# Altium project Mother_board_sauvc_2025.PrjPcb
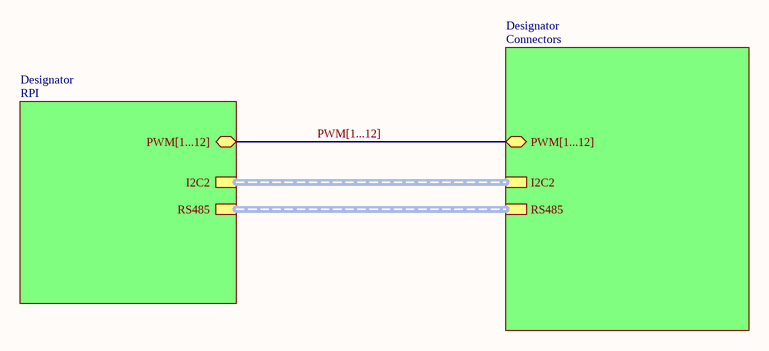
[diagram p0: Mother_board_sauvc_2025.SchDoc]
4 sheets, 34 parts. Net scope: global (net labels, ports and power ports of the same name join across sheets).
Board file: Mother_board_sauvc_2025.PcbDoc
Sheets:
  Mother_board_sauvc_2025.SchDoc
    Designator = RPI.SchDoc
    Designator = Connectors.SchDoc
  Power.SchDoc

## Sheet Mother_board_sauvc_2025.SchDoc
size A4; SheetNumber: 1; SheetTotal: 4

### Sub-sheets
Designator = RPI: PWM[1...12] (bidir), I2C2 (harness *), RS485 (harness *)
Designator = Connectors: PWM[1...12] (bidir), I2C2 (harness *), RS485 (harness *)

### Buses and harness runs
bus PWM[1...12] = sheet Designator/PWM[1...12]

## Sheet RPI.SchDoc
size A3; SheetNumber: 2; SheetTotal: 4
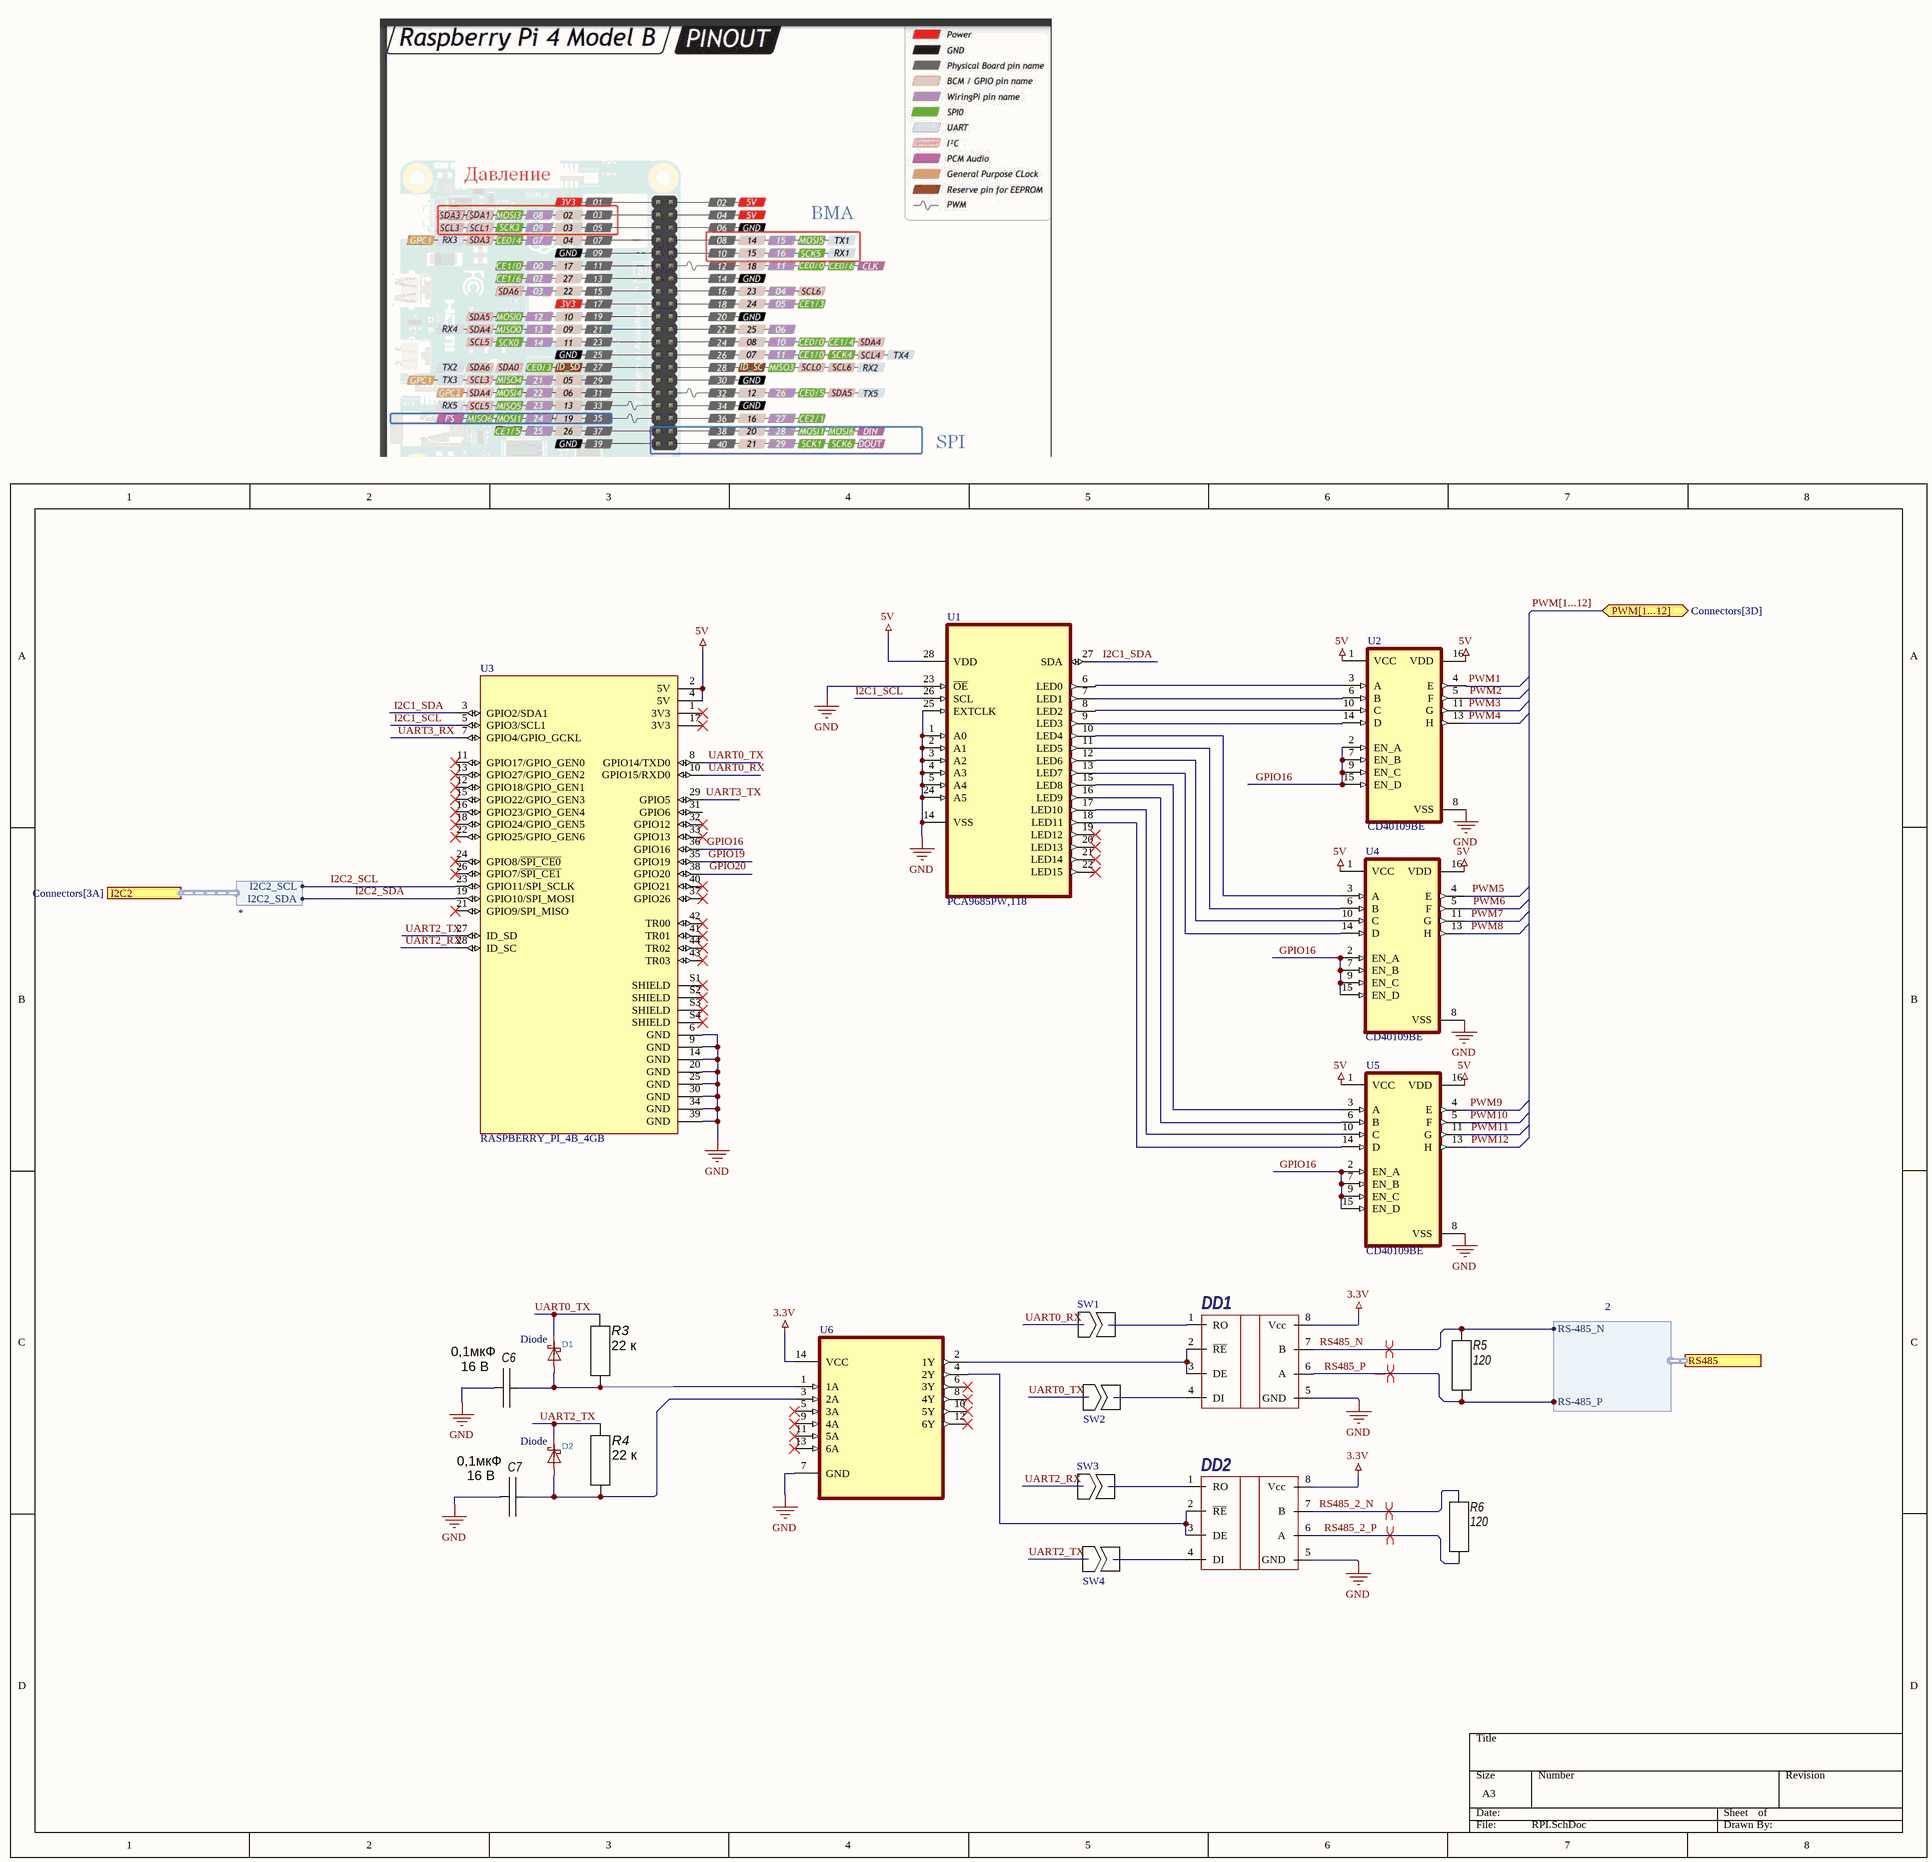
[diagram p1: RPI.SchDoc]

### Parts
C6  Voltage: 16 В  [C0603C]  (hidden comment: 0,1мкФ)
C7  Voltage: 16 В  [C0603C]  (hidden comment: 0,1мкФ)
D1  Diode  [SOD-123F]
D2  Diode  [SOD-123F]
DD1  (no value)  [SOIC8N]
DD2  (no value)  [SOIC8N]
R3  22 к  [C0603R]
R4  22 к  [C0603R]
R5  120  [C0603R]
R6  120  [C0603R]
SW1  SW2  [SW2]  (value not drawn)
SW2  SW2  [SW2]  (value not drawn)
SW3  SW2  [SW2]  (value not drawn)
SW4  SW2  [SW2]  (value not drawn)
U1  PCA9685PW,118  [SOP65P640X110-28N]
U2  CD40109BE  [DIP794W45P254L1969H508Q16]
U3  RASPBERRY_PI_4B_4GB  [PLD40]
U4  CD40109BE  [DIP794W45P254L1969H508Q16]
U5  CD40109BE  [DIP794W45P254L1969H508Q16]
U6  (no value)  [SOIC127P600X175-14N]

### Ports
I2C2 (harness *, see Connectors[3A]), PWM[1...12] (bidir, see Connectors[3D]), RS485 (harness 2, see Connectors[1C])

### Harnesses
*: I2C2_SCL, I2C2_SDA
2: RS-485_N, RS-485_P

### Nets
3.3V: DD1.8(Vcc) DD2.8(Vcc) U6.14(VCC)
5V: U1.28(VDD) U2.1(VCC) U2.16(VDD) U3.2(5V) U3.4(5V) U4.1(VCC) U4.16(VDD) U5.1(VCC) U5.16(VDD)
GND: C6.2 C7.2 DD1.5(GND) DD2.5(GND) U1.1(A0) U1.2(A1) U1.3(A2) U1.4(A3) U1.5(A4) U1.14(VSS) U1.23(~{OE}) U1.24(A5) U1.25(EXTCLK) U2.8(VSS) U3.6(GND) U3.9(GND) U3.14(GND) U3.20(GND) U3.25(GND) U3.30(GND) U3.34(GND) U3.39(GND) U4.8(VSS) U5.8(VSS) U6.7(GND)
GPIO16: U2.2(EN_A) U2.7(EN_B) U2.9(EN_C) U2.15(EN_D) U3.36(GPIO16) U4.2(EN_A) U4.7(EN_B) U4.9(EN_C) U4.15(EN_D) U5.2(EN_A) U5.7(EN_B) U5.9(EN_C) U5.15(EN_D)
GPIO19: U3.35(GPIO19)
GPIO20: U3.38(GPIO20)
I2C1_SCL: U1.26(SCL) U3.5(GPIO3/SCL1)
I2C1_SDA: U1.27(SDA) U3.3(GPIO2/SDA1)
I2C2_SCL: U3.23(GPIO11/SPI_SCLK) ; port I2C2.I2C2_SCL
I2C2_SDA: U3.19(GPIO10/SPI_MOSI) ; port I2C2.I2C2_SDA
PWM1: U2.4(E)
PWM2: U2.5(F)
PWM3: U2.11(G)
PWM4: U2.13(H)
PWM5: U4.4(E)
PWM6: U4.5(F)
PWM7: U4.11(G)
PWM8: U4.13(H)
PWM9: U5.4(E)
PWM10: U5.5(F)
PWM11: U5.11(G)
PWM12: U5.13(H)
RS485_2_N: DD2.7(B) R6.1
RS485_2_P: DD2.6(A) R6.2
RS485_N: DD1.7(B) R5.1 ; port RS485.RS-485_N  [project net RS-485_N]
RS485_P: DD1.6(A) R5.2 ; port RS485.RS-485_P  [project net RS-485_P]
UART0_RX: SW1.1 U3.10(GPIO15/RXD0)
UART0_TX: D1.K R3.1 SW2.1 U3.8(GPIO14/TXD0)
UART2_RX: SW3.1 U3.28(ID_SC)
UART2_TX: D2.K R4.1 SW4.1 U3.27(ID_SD)
UART3_RX: U3.7(GPIO4/GPIO_GCKL)
UART3_TX: U3.29(GPIO5)
NetC6_1: C6.1 D1.A R3.2 U6.1(1A)
NetC7_1: C7.1 D2.A R4.2 U6.3(2A)
NetDD1_1: DD1.1(RO) SW1.2
NetDD1_2: DD1.2(~{RE}) DD1.3(DE) U6.2(1Y)
NetDD1_4: DD1.4(DI) SW2.2
NetDD2_1: DD2.1(RO) SW3.2
NetDD2_2: DD2.2(~{RE}) DD2.3(DE) U6.4(2Y)
NetDD2_4: DD2.4(DI) SW4.2
NetU1_6: U1.6(LED0) U2.3(A)
NetU1_7: U1.7(LED1) U2.6(B)
NetU1_8: U1.8(LED2) U2.10(C)
NetU1_9: U1.9(LED3) U2.14(D)
NetU1_10: U1.10(LED4) U4.3(A)
NetU1_11: U1.11(LED5) U4.6(B)
NetU1_12: U1.12(LED6) U4.10(C)
NetU1_13: U1.13(LED7) U4.14(D)
NetU1_15: U1.15(LED8) U5.3(A)
NetU1_16: U1.16(LED9) U5.6(B)
NetU1_17: U1.17(LED10) U5.10(C)
NetU1_18: U1.18(LED11) U5.14(D)

Not connected (* = marked no-connect by the designer): U1 19(LED12)* 20(LED13)* 21(LED14)* 22(LED15)*; U3 1(3V3)* 11(GPIO17/GPIO_GEN0)* 12(GPIO18/GPIO_GEN1)* 13(GPIO27/GPIO_GEN2)* 15(GPIO22/GPIO_GEN3)* 16(GPIO23/GPIO_GEN4)* 17(3V3)* 18(GPIO24/GPIO_GEN5)* 21(GPIO9/SPI_MISO)* 22(GPIO25/GPIO_GEN6)* 24(GPIO8/~{SPI_CE0})* 26(GPIO7/~{SPI_CE1})* 31(GPIO6) 32(GPIO12)* 33(GPIO13)* 37(GPIO26)* 40(GPIO21)* 41(TR01)* 42(TR00)* 43(TR03)* 44(TR02)* S1(SHIELD)* S2(SHIELD)* S3(SHIELD)* S4(SHIELD)*; U6 5(3A)* 6(3Y)* 8(4Y)* 9(4A)* 10(5Y)* 11(5A)* 12(6Y)* 13(6A)*

### Buses and harness runs
bus PWM[1...12] = port PWM[1...12]

### Layout directives
differential pair: RS485_2_N, RS485_2_P, RS-485_N, RS-485_P

### Library data of the parts
C6 C7 = CL10B152KB8NNNC: SMD 0603 ; X7R; 1,5 нФ; 50 В; Manufacturer: SAMSUNG; Persent: ±15%; Type: Ceramic; Part Number: CL10B152KB8NNNC; Package: SMD 0603; Dielectric: X7R; ComponentLink1Description: Datasheet; Value: 0,1мкФ
D1 D2 = Schottky-Diode: ki_description: Schottky Diode; Datasheet: https://diotec.com/de/produktliste/SBD.html; ki_keywords: Schottky
DD1 DD2 = MAX3072E: Half-duplex; Manufacturer: MAXIM; Rate: 3.3v; Notice: True fail-safe; Datasheet: https://static.chipdip.ru/lib/276/DOC000276899.pdf; Shop: https://www.chipdip.ru/product/max3072eesa; Case: soic-8(0.154 inch)
R3 R4 = RC0603FR-0722KL: SMD 0603; 0,1; 1%; 22 кОм; Manufacturer: Yageo; Power: 0,1; TCR: 200 ppm; Part Number: RC0603FR-0722KL; Package: SMD 0603; Persent: 1%; Category: R; Value: 22 к
R5 R6 = RC0603FR-07120RL: SMD 0603; 0,1; 1%; 120 Ом; Manufacturer: Yageo; Power: 0,1; TCR: 200 ppm; Part Number: RC0603FR-07120RL; Package: SMD 0603; Persent: 1%; Value: 120; Category: R
U1 = PCA9685PW,118: LED Driver IC 16 Output Linear - PWM Dimming 25mA 28-TSSOP; MF: NXP USA; Value: *; MP: PCA9685PW,118; Purchase-URL: https://pricing.snapeda.com/search/part/PCA9685PW,118/?ref=eda; Availability: In Stock; Price: None; Package: TSSOP-28 NXP Semiconductors
U2 U4 U5 = CD40109BE: Ð§ÐµÑ‚Ñ‹Ñ€ÐµÑ…ÑŠÑÐ´ÐµÑ€Ð½Ñ‹Ð¹ ÐšÐœÐžÐŸ-Ð¿Ñ€ÐµÐ¾Ð±Ñ€Ð°Ð·Ð¾Ð²Ð°Ñ‚ÐµÐ»ÑŒ Ð½Ð¸Ð·ÐºÐ¾Ð³Ð¾ Ð½Ð°Ð¿Ñ€ÑÐ¶ÐµÐ½Ð¸Ñ Ð² Ð²Ñ‹ÑÐ¾ÐºÐ¾Ðµ (Ð½Ð¾Ð¼Ð¸Ð½Ð°Ð»ÑŒÐ½Ð¾Ðµ Ð½Ð°Ð¿Ñ€ÑÐ¶ÐµÐ½Ð¸Ðµ 20 Ð’); MF: Texas Instruments; SnapEDA_Link: https://www.snapeda.com/parts/CD40109BE/Texas+Instruments/view-part/?ref=snap; Package: PDIP-16 Texas Instruments; Value: *; MP: CD40109BE; Check_prices: https://www.snapeda.com/parts/CD40109BE/Texas+Instruments/view-part/?ref=eda
U3 = RASPBERRY_PI_4B_4GB: BCM2711 Raspberry Pi 4 Model B 4GB - ARMÂ® CortexÂ®-A72 MPU Embedded Evaluation Board; MP: RASPBERRY PI 4B/4GB; Price: None; MF: Raspberry Pi; Check_prices: https://www.snapeda.com/parts/RASPBERRY%20PI%204B/4GB/Raspberry+Pi/view-part/?ref=eda; Value: *; Purchase-URL: https://pricing.snapeda.com/search/part/RASPBERRY PI 4B/4GB/?ref=eda; Availability: In Stock; SnapEDA_Link: https://www.snapeda.com/parts/RASPBERRY%20PI%204B/4GB/Raspberry+Pi/view-part/?ref=snap; Package: None
U6 = 74HC14D: Inverter IC 6 Channel Schmitt Trigger 14-SOIC; MF: Toshiba; SnapEDA_Link: https://www.snapeda.com/parts/74HC14D/Toshiba+Semiconductor+and+Storage/view-part/?ref=snap; Availability: In Stock; Price: None; Package: SO14-14 Nexperia USA Inc.; Purchase-URL: https://pricing.snapeda.com/search/part/74HC14D/?ref=eda; Check_prices: https://www.snapeda.com/parts/74HC14D/Toshiba+Semiconductor+and+Storage/view-part/?ref=eda; Value: *; MP: 74HC14D

## Sheet Connectors.SchDoc
size A4; SheetNumber: 3; SheetTotal: 4
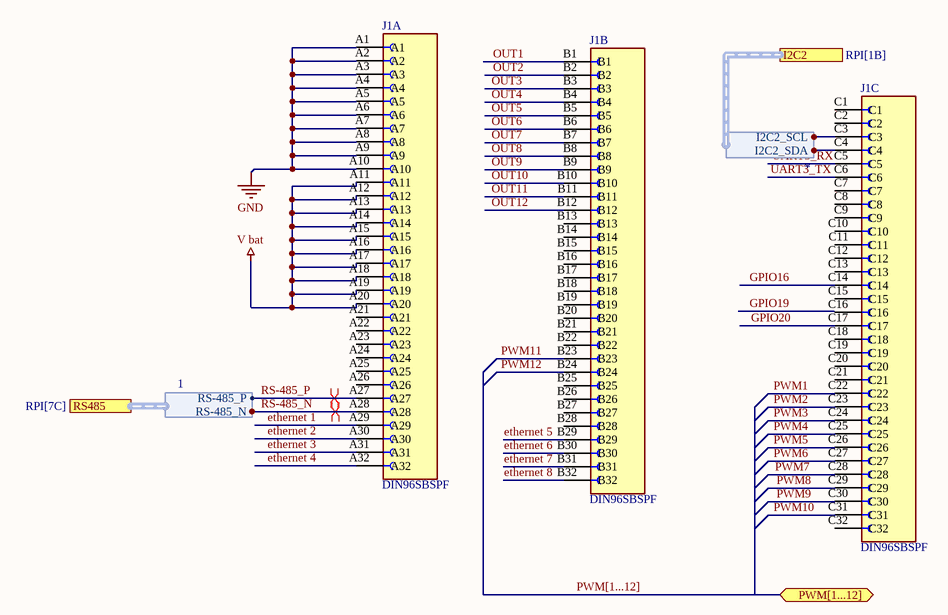
[diagram p2: Connectors.SchDoc]

### Parts
J1  DIN96SBSPF  [CINCH_DIN96SBSPF]  (parts A,B,C of 3)

### Ports
I2C2 (harness *, see RPI[1B]), PWM[1...12] (bidir, see RPI[7A]), RS485 (harness 1, see RPI[7C])

### Harnesses
1: RS-485_P, RS-485_N
*: I2C2_SCL, I2C2_SDA

### Nets
GND: J1.A1 J1.A2 J1.A3 J1.A4 J1.A5 J1.A6 J1.A7 J1.A8 J1.A9 J1.A10
V bat: J1.A11 J1.A12 J1.A13 J1.A14 J1.A15 J1.A16 J1.A17 J1.A18 J1.A19 J1.A20
ethernet 1: J1.A29
ethernet 2: J1.A30
ethernet 3: J1.A31
ethernet 4: J1.A32
ethernet 5: J1.B29
ethernet 6: J1.B30
ethernet 7: J1.B31
ethernet 8: J1.B32
GPIO16: J1.C14
GPIO20: J1.C17
I2C2_SCL: J1.C3 ; port I2C2.I2C2_SCL
I2C2_SDA: J1.C4 ; port I2C2.I2C2_SDA
OUT1: J1.B1
OUT2: J1.B2
OUT3: J1.B3
OUT4: J1.B4
OUT5: J1.B5
OUT6: J1.B6
OUT7: J1.B7
OUT8: J1.B8
OUT9: J1.B9
OUT10: J1.B10
OUT11: J1.B11
OUT12: J1.B12
PWM1: J1.C22
PWM2: J1.C23
PWM3: J1.C24
PWM4: J1.C25
PWM5: J1.C26
PWM6: J1.C27
PWM7: J1.C28
PWM8: J1.C29
PWM9: J1.C30
PWM10: J1.C31
PWM11: J1.B23
PWM12: J1.B24
RS-485_N: J1.A28 ; port RS485.RS-485_N
RS-485_P: J1.A27 ; port RS485.RS-485_P
UART3_RX: J1.C5
UART3_TX: J1.C6

Not connected (* = marked no-connect by the designer): J1 A21 A22 A23 A24 A25 A26 B13 B14 B15 B16 B17 B18 B19 B20 B21 B22 B25 B26 B27 B28 C1 C2 C7 C8 C9 C10 C11 C12 C13 C15 C16 C18 C19 C20 C21 C32

### Buses and harness runs
bus PWM[1...12] = port PWM[1...12]

### Layout directives
differential pair: RS-485_N, RS-485_P

### Library data of the parts
J1 = DIN96SBSPF: DIN 41612 socket, fully populated, 96 contacts, straight PCB mounted, press-fit pins; MF: Cinch Connectivity Solutions; Package: None; Price: None; Check_prices: https://www.snapeda.com/parts/DIN96SBSPF/Cinch+Connectivity+Solutions/view-part/?ref=eda; Value: *; SnapEDA_Link: https://www.snapeda.com/parts/DIN96SBSPF/Cinch+Connectivity+Solutions/view-part/?ref=snap; MP: DIN96SBSPF; Availability: In Stock; Purchase-URL: https://pricing.snapeda.com/search?q=DIN96SBSPF&ref=eda

## Sheet Power.SchDoc
size A4; SheetNumber: 4; SheetTotal: 4
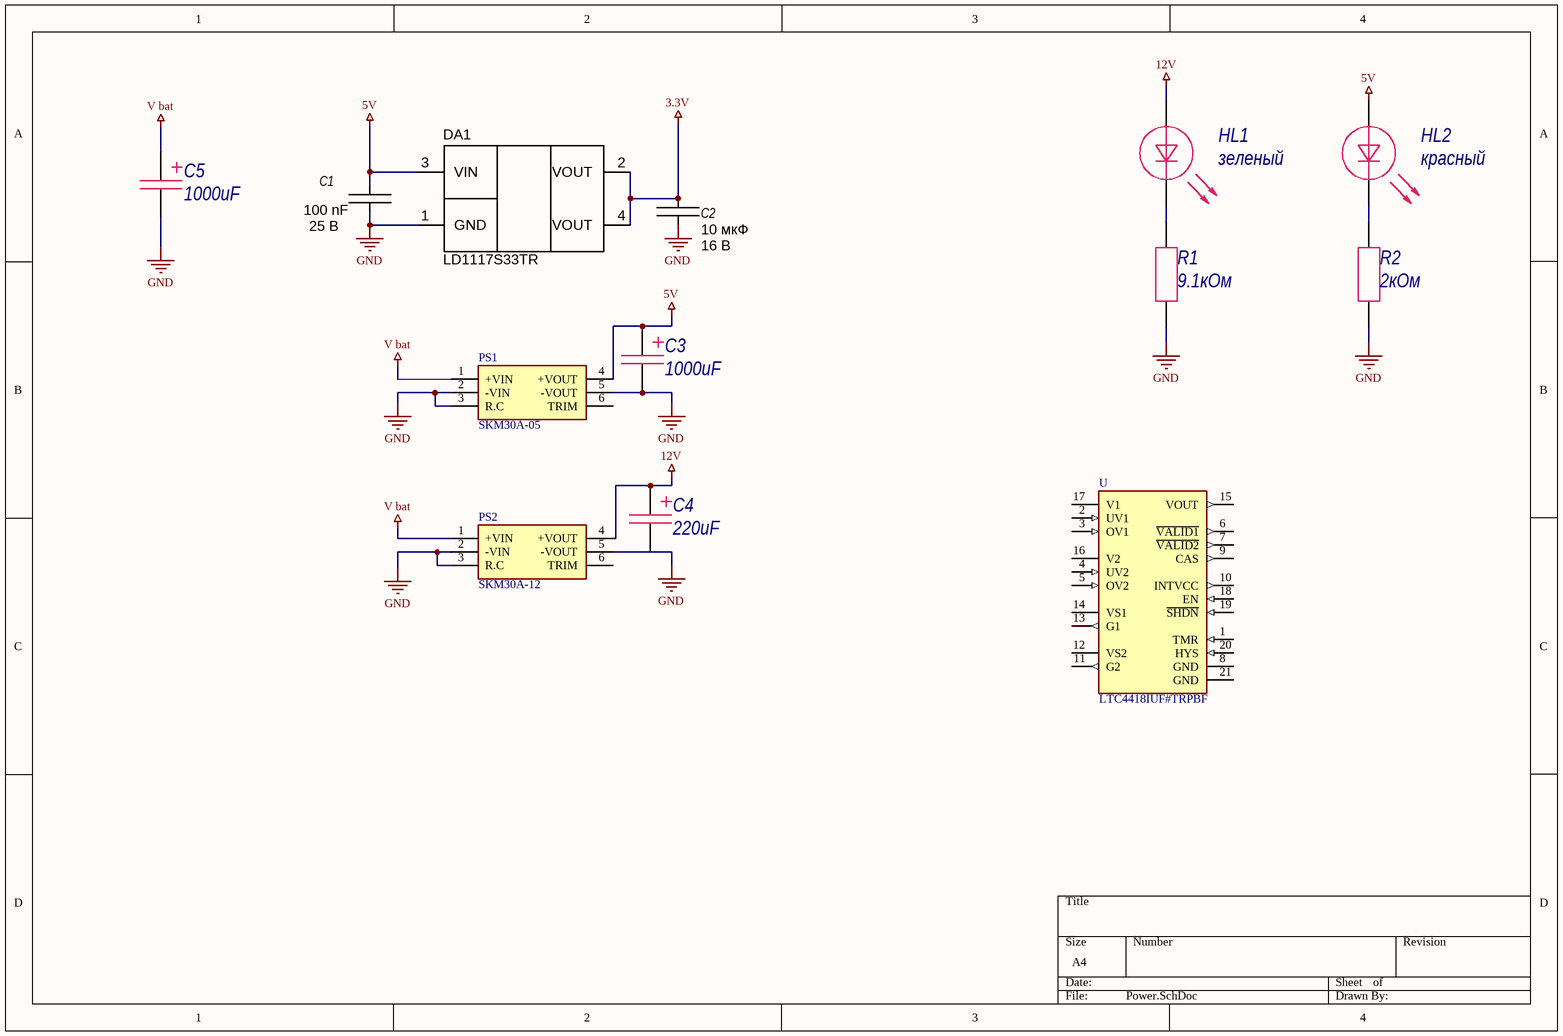
[diagram p3: Power.SchDoc]

### Parts
C1  Voltage: 25 В  [C0402C]  (hidden comment: 100 nF)
C2  Voltage: 16 В  [C0805C]  (hidden comment: 10 мкФ)
C3  value 1000uF  [Capacitor 8x12]  (hidden comment: 1uF)
C4  value 220uF  [Capacitor 8x12]  (hidden comment: 1uF)
C5  value 1000uF  [Capacitor 10x12]  (hidden comment: 1uF)
DA1  LD1117S33TR  [SOT-223]
HL1  Color: зеленый  [0805D]
HL2  Color: красный  [0805D]
PS1  SKM30A-05  [SKM30A05]
PS2  SKM30A-12  [SKM30B12]
R1  value 9.1кОм  [0805R]  (hidden comment: Resistor)
R2  value 2кОм  [0805R]  (hidden comment: Resistor)
U  LTC4418IUF#TRPBF  [QFN50P400X400X80-21N]

### Nets
3.3V: C2.1 DA1.2(VOUT) DA1.4(VOUT)
5V: C1.1 C3.1 DA1.3(VIN) HL2.1 PS1.4(+VOUT)
12V: C4.1 HL1.1 PS2.4(+VOUT)
GND: C1.2 C2.2 C3.2 C4.2 C5.2 DA1.1(GND) PS1.2(-VIN) PS1.3(R.C) PS1.5(-VOUT) PS2.2(-VIN) PS2.3(R.C) PS2.5(-VOUT) R1.1 R2.1
V bat: C5.1 PS1.1(+VIN) PS2.1(+VIN)
NetHL1_2: HL1.2 R1.2
NetHL2_2: HL2.2 R2.2

Not connected (* = marked no-connect by the designer): PS1 6(TRIM); PS2 6(TRIM); U 1(TMR) 2(UV1) 3(OV1) 4(UV2) 5(OV2) 6(~{VALID1}) 7(~{VALID2}) 8(GND) 9(CAS) 10(INTVCC) 11(G2) 12(VS2) 13(G1) 14(VS1) 15(VOUT) 16(V2) 17(V1) 18(EN) 19(~{SHDN}) 20(HYS) 21(GND)

### Library data of the parts
C1 = CL05B103KA5NNNC: SMD 0603 ; X7R; 0,01 мкФ; 25 В; Manufacturer: SAMSUNG; Persent: ±10%; Type: Ceramic; Part Number: CL05B103KA5NNNC; Package: SMD 0402; Dielectric: X7R; ComponentLink1Description: Datasheet; Value: 100 nF
C2 = CL21B106KOQNNNE: SMD 0805; X7R; 10 мкФ; 16 В; Manufacturer: SAMSUNG; Persent: ±15%; Type: Ceramic; Part Number: CL21B106KOQNNNE; Package: SMD 0805; Dielectric: X7R; ComponentLink1Description: Datasheet; Value: 10 мкФ
C3-C5 = Capacitor_pol
DA1 = LD1117S33TR: Linear regulator, 3V3; Manufacturer: STMicroelectronics; Type: Linear regulator; Part Number: LD1117S33TR
HL1 HL2 = LED: Manufacturer: -; Rate: -; Datasheet: -; Shop: -; Notice: -; Case: -
PS1 = SKM30A-05: Power Supply; Manufacturer_Name: Mean Well; Datasheet Link: https://www.meanwell.com/webapp/product/search.aspx?prod=SKM30; Height: 11.2mm; Manufacturer_Part_Number: SKM30A-05; Mouser Part Number: 709-SKM30A-05; Mouser Price/Stock: https://www.mouser.co.uk/ProductDetail/MEAN-WELL/SKM30A-05?qs=WtedIhRlNpsvgfTGPi4UAw%3D%3D
PS2 = SKM30A-12: Power Supply; Manufacturer_Name: Mean Well; Datasheet Link: https://www.meanwell.com/webapp/product/search.aspx?prod=SKM30; Height: 11.2mm; Manufacturer_Part_Number: SKM30A-12; Mouser Part Number: 709-SKM30A-12; Mouser Price/Stock: https://www.mouser.co.uk/ProductDetail/MEAN-WELL/SKM30A-12?qs=WtedIhRlNpuG9wDURm5lSA%3D%3D; Arrow Part Number: SKM30A-12; Arrow Price/Stock: https://www.arrow.com/en/products/skm30a-12/mean-well-enterprises
U = LTC4418IUF#TRPBF: OR Controller Source Selector Switch P-Channel 2:1 20-QFN _4x4_; MF: Analog Devices; SnapEDA_Link: https://www.snapeda.com/parts/LTC4418IUF%23TRPBF/Analog%20Devices/view-part/2882983/?ref=snap; MP: LTC4418IUF#TRPBF; Price: None; Availability: Unavailable; Value: *; Package: QFN -20 Analog Devices

## Nets that join several sheets
3.3V: RPI (DD1.8 DD2.8 U6.14), Power (C2.1 DA1.2 DA1.4)
5V: RPI (9 pins), Power (5 pins)
GND: RPI (25 pins), Connectors (10 pins), Power (14 pins)
V bat: Connectors (10 pins), Power (C5.1 PS1.1 PS2.1)
GPIO16: RPI (13 pins), Connectors (J1.C14)
GPIO20: RPI (U3.38), Connectors (J1.C17)
I2C2_SCL: RPI (U3.23), Connectors (J1.C3)
I2C2_SDA: RPI (U3.19), Connectors (J1.C4)
PWM1: RPI (U2.4), Connectors (J1.C22)
PWM2: RPI (U2.5), Connectors (J1.C23)
PWM3: RPI (U2.11), Connectors (J1.C24)
PWM4: RPI (U2.13), Connectors (J1.C25)
PWM5: RPI (U4.4), Connectors (J1.C26)
PWM6: RPI (U4.5), Connectors (J1.C27)
PWM7: RPI (U4.11), Connectors (J1.C28)
PWM8: RPI (U4.13), Connectors (J1.C29)
PWM9: RPI (U5.4), Connectors (J1.C30)
PWM10: RPI (U5.5), Connectors (J1.C31)
PWM11: RPI (U5.11), Connectors (J1.B23)
PWM12: RPI (U5.13), Connectors (J1.B24)
RS-485_N: RPI (DD1.7 R5.1), Connectors (J1.A28)
RS-485_P: RPI (DD1.6 R5.2), Connectors (J1.A27)
UART3_RX: RPI (U3.7), Connectors (J1.C5)
UART3_TX: RPI (U3.29), Connectors (J1.C6)